# EAGLE design AccessControl (EAGLE 6.3)
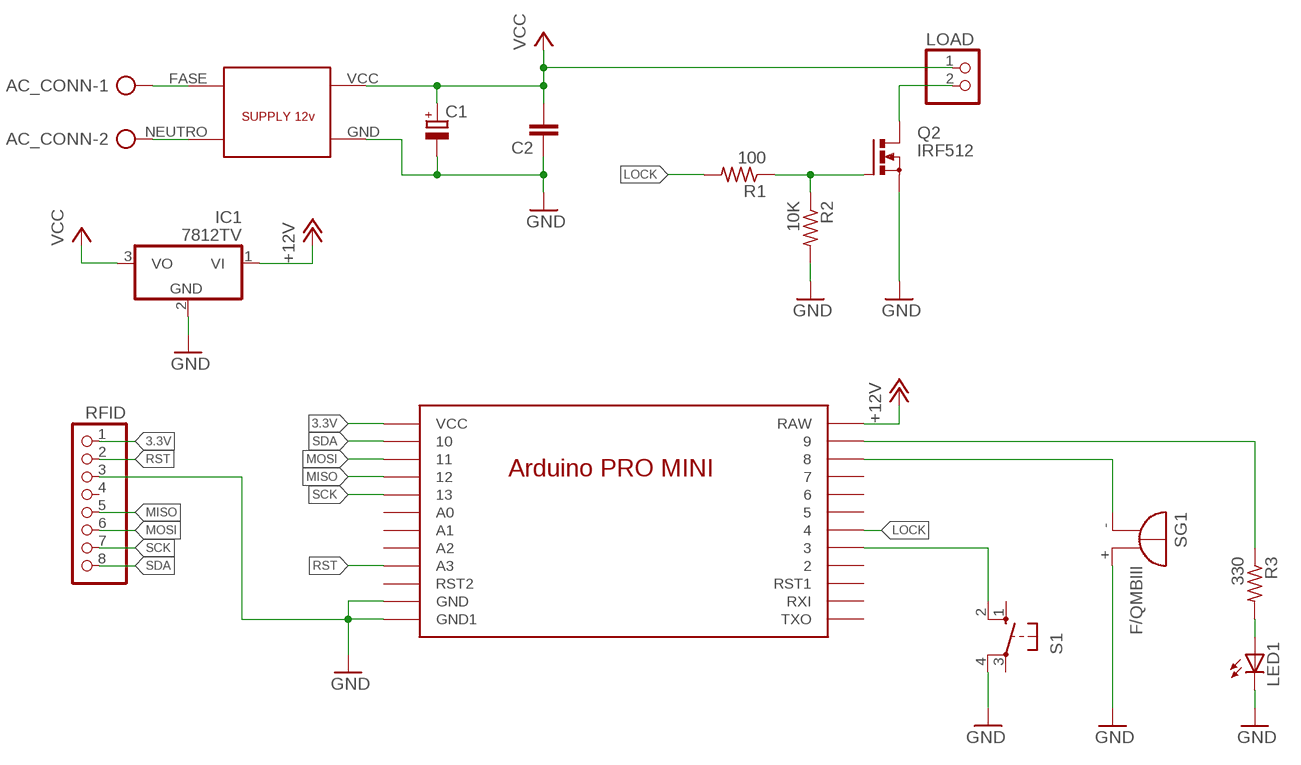
[diagram p0: schematic, sheet 1]

## Parts
AC_CONN  AK300/2  [AK300/2]
C1  CPOL-EUE2.5-6  [E2,5-6]
C2  C2.5/2  [C2.5-2]
IC1  7812TV  [TO220V]
LED1  LED3MM  [LED3MM]
LOAD  PINHD-1X2  [1X02]
Q2  IRF512  [TO220BV]
R1  100  R-US_0204/7  [0204/7]
R2  10K  R-US_0204/7  [0204/7]
R3  330  R-US_0204/7  [0204/7]
RFID  PINHD-1X8  [1X08]
S1  10-XX  [B3F-10XX]
SG1  F/QMBIII  [F/QMBIII]
U$1  NANO  [NANO]
U$2  SUPPLY12V  [SUPPLY12V]

## Nets
3.3V: RFID.1 U$1.VCC
+12V: IC1.1(VI) U$1.RAW
GND: C1.- C2.1 IC1.2(GND) LED1.K(C) Q2.S R2.2 RFID.3 S1.4(P1) SG1.+(-) U$1.GND1(GND) U$1.GND2(GND1) U$2.GND
LOCK: R1.2 U$1.4
MISO: RFID.5 U$1.12
MOSI: RFID.6 U$1.11
N$1: Q2.G R1.1 R2.1
N$2: AC_CONN.2 U$2.NEUTRO
N$3: LOAD.2 Q2.D
N$4: LED1.A R3.2
N$5: AC_CONN.1 U$2.FASE
N$6: SG1.-(+) U$1.8
N$7: S1.2(S1) U$1.3
N$8: R3.1 U$1.9
RST: RFID.2 U$1.A3
SCK: RFID.7 U$1.13
SDA: RFID.8 U$1.10
VCC: C1.+ C2.2 IC1.3(VO) LOAD.1 U$2.VCC
Unconnected: RFID.4 S1.1(S) S1.3(P) U$1.2 U$1.5 U$1.6 U$1.7 U$1.A0 U$1.A1 U$1.A2 U$1.RST1 U$1.RST2 U$1.RXI U$1.TXO

## Library data of the parts
AC_CONN = con-ptr500:AK300/2: CONNECTOR; OC_FARNELL: unknown; OC_NEWARK: unknown
C1 = resistor:CPOL-EU: POLARIZED CAPACITOR, European symbol
C2 = capacitor-wima:C: CAPACITOR naming: grid - package width
IC1 = linear:78*: Positive VOLTAGE REGULATOR Source: http://cache.national.com/ds/LM/LM78L05.pdf http://www.fairchildsemi.com/ds/LM/LM7805.pdf
LED1 = led:LED: LED OSRAM: - CHIPLED LG R971, LG N971, LY N971, LG Q971, LY Q971, LO R971, LY R971 LH N974, LH R974 LS Q976, LO Q976, LY Q976 LO Q996 - Hyper CHIPLED LW Q18S LB Q993, LB Q99A, LB R99A - SideLED LS A670, LO A670, LY A670, LG A670, LP A670 LB A673, LV A673, LT A673, LW A673 LH A674 LY A675 LS A676, LA A676, LO A676, LY A676, LW A676 LS A679, LY A679, LG A679 - Hyper Micro SIDELED® LS Y876, LA Y876, LO Y876, LY Y876 LT Y87S - SmartLED LW L88C, LW L88S LB L89C, LB L89S, LG L890 LS L89K, LO L89K, LY L89K LS L896, LA L896, LO L896, LY L896 - TOPLED LS T670, LO T670, LY T670, LG T670, LP T670 LSG T670, LSP T670, LSY T670, LOP T670, LYG T670 LG T671, LOG T671, LSG T671 LB T673, LV T673, LT T673, LW T673 LH T674 LS T676, LA T676, LO T676, LY T676, LB T676, LH T676, LSB T676, LW T676 LB T67C, LV T67C, LT T67C, LS T67K, LO T67K, LY T67K, LW E67C LS E67B, LA E67B, LO E67B, LY E67B, LB E67C, LV E67C, LT E67C LW T67C LS T679, LY T679, LG T679 LS T770, LO T770, LY T770, LG T770, LP T770 LB T773, LV T773, LT T773, LW T773 LH T774 LS E675, LA E675, LY E675, LS T675 LS T776, LA T776, LO T776, LY T776, LB T776 LHGB T686 LT T68C, LB T68C - Hyper Mini TOPLED® LB M676 - Mini TOPLED Santana® LG M470 LS M47K, LO M47K, LY M47K Source: http://www.osram.convergy.de LUXEON: - LUMILED® LXK2-PW12-R00, LXK2-PW12-S00, LXK2-PW14-U00, LXK2-PW14-V00 LXK2-PM12-R00, LXK2-PM12-S00, LXK2-PM14-U00 LXK2-PE12-Q00, LXK2-PE12-R00, LXK2-PE12-S00, LXK2-PE14-T00, LXK2-PE14-U00 LXK2-PB12-K00, LXK2-PB12-L00, LXK2-PB12-M00, LXK2-PB14-N00, LXK2-PB14-P00, LXK2-PB14-Q00 LXK2-PR12-L00, LXK2-PR12-M00, LXK2-PR14-Q00, LXK2-PR14-R00 LXK2-PD12-Q00, LXK2-PD12-R00, LXK2-PD12-S00 LXK2-PH12-R00, LXK2-PH12-S00 LXK2-PL12-P00, LXK2-PL12-Q00, LXK2-PL12-R00 Source: www.luxeon.com KINGBRIGHT: KA-3528ASYC Source: www.kingbright.com
LOAD = pinhead:PINHD-1X2: PIN HEADER
Q2 = transistor-power:IRF512: N-CHANNEL MOS FET
R1-R3 = resistor:R-US_: RESISTOR, American symbol
RFID = pinhead:PINHD-1X8: PIN HEADER
S1 = switch-omron:10-XX: OMRON SWITCH; MPN: B3F-1000; OC_FARNELL: 176432; OC_NEWARK: 36M3542
SG1 = buzzer:F/QMBIII: BUZZER Source: Buerklin; OC_FARNELL: unknown; OC_NEWARK: unknown
U$1 = E-Lab:NANO
U$2 = E-Lab:SUPPLY12V

## Board
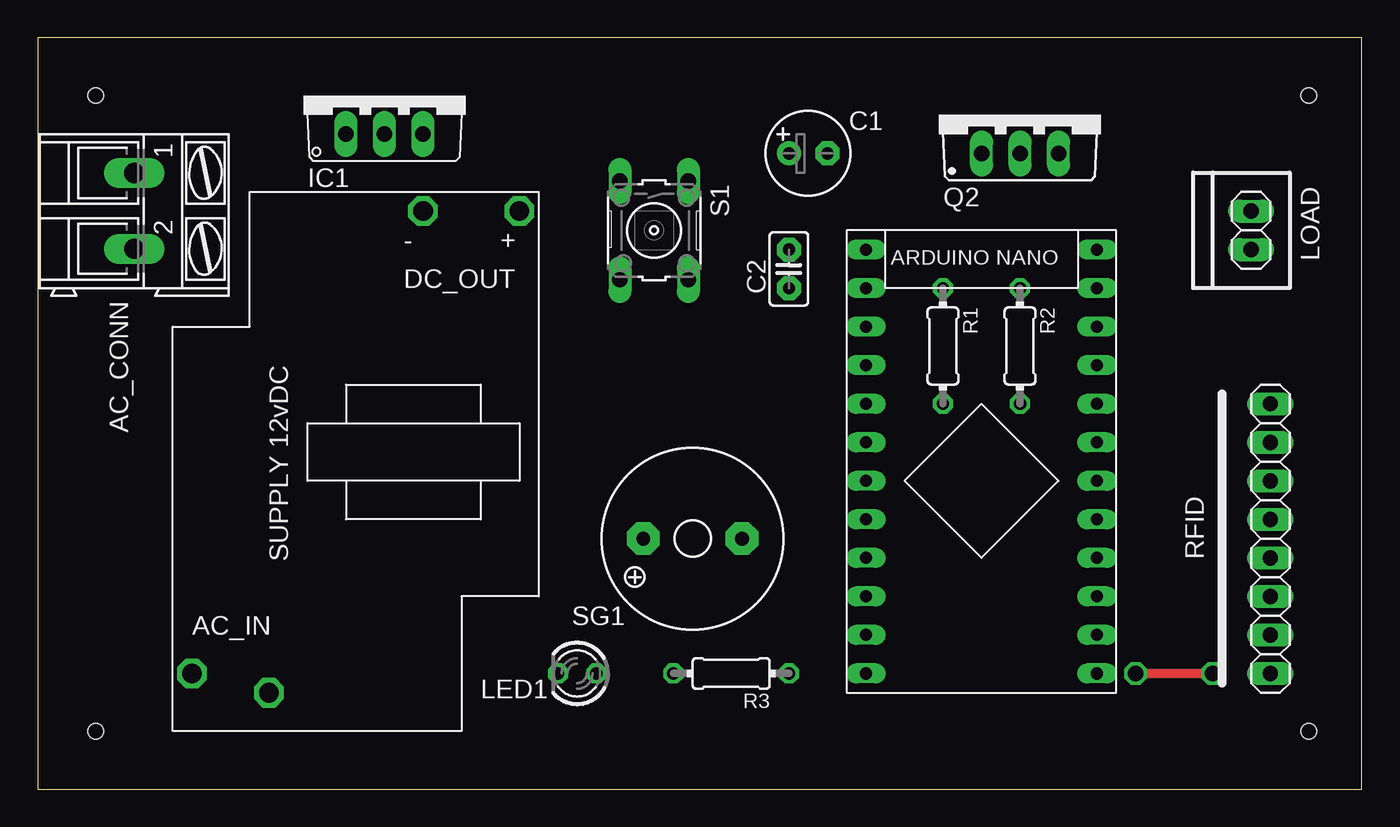
[diagram p1: board, top side]
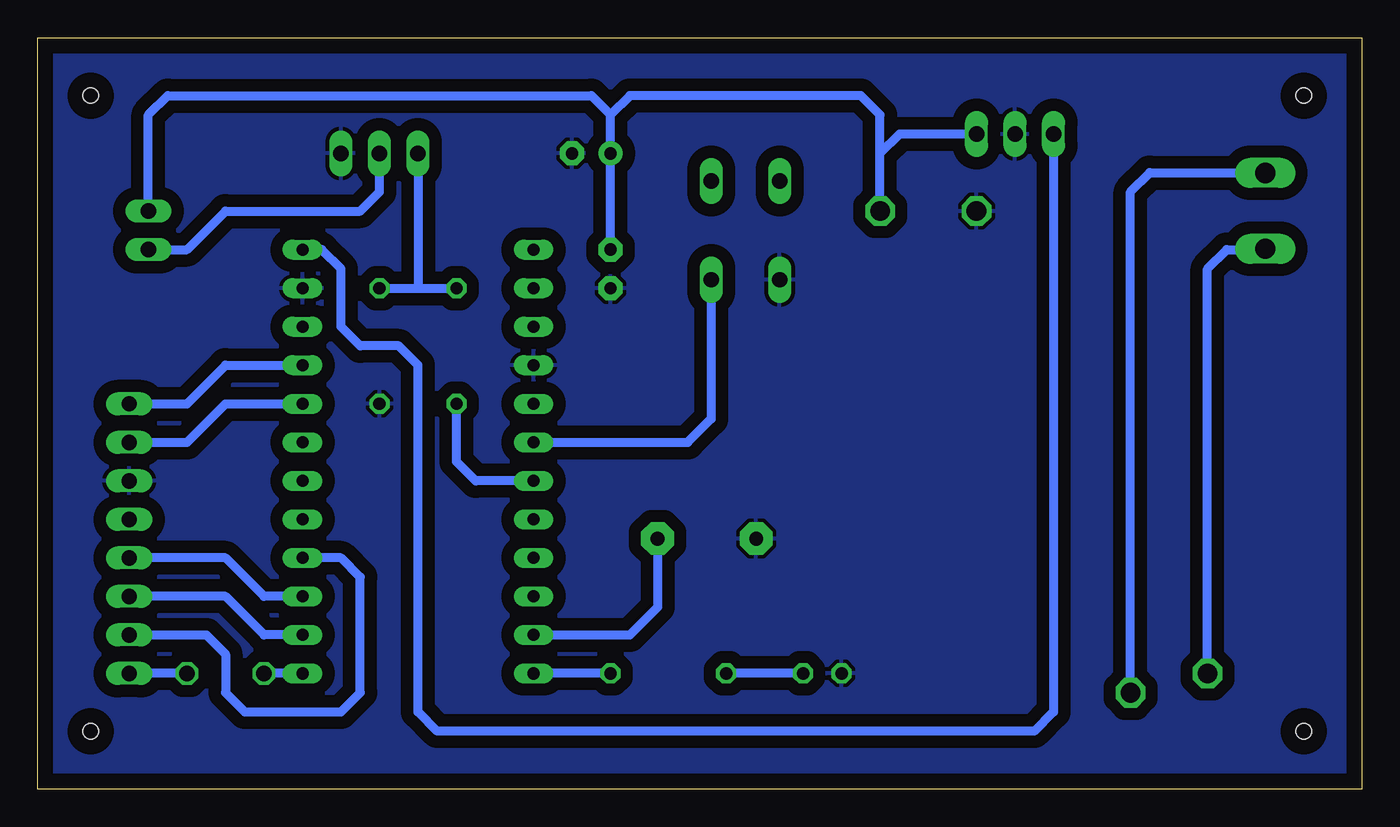
[diagram p2: board, bottom side, seen from below]

Size 87.3 x 49.52 mm. Coordinates in mm from the lower left corner, seen from the top.
Outline: 0,0 87.3,0 87.3,49.52 0,49.52 0,0
Copper layers (1*16): Top 0.035mm / dielectric 1.5mm / Bottom 0.035mm
Design rules "default": minimum track width 10mil, minimum drill 24mil, track to track 8mil, track to pad 8mil, pad to pad 8mil, via to via 8mil, smd to smd 8mil, copper to edge 40mil, drill to drill 8mil, minimum pad ring 10mil, minimum via ring 8mil, stop-mask expansion 4mil, vias tented up to drill 0mil, thermal gap 10mil
Holes 1 mm at 3.81,3.81 3.81,45.72 83.82,45.72 83.82,3.81

### Footprints (pad centres in the part's own frame; a part is rotated, then mirrored left to right if it is on the bottom)
AK300/2 = drill 1.321 long: 1 -2.515,0; 2 2.489,0
E2,5-6 = drill 0.813 pad 1.6: + -1.27,0 | drill 0.813 pad 1.6 octagon: - 1.27,0
C2.5-2 = drill 0.813 pad 1.6 octagon: 1 -1.27,0; 2 1.27,0
TO220V = drill 1.016 long: 1 -2.54,-2.54; 2 0,-2.54; 3 2.54,-2.54
LED3MM = drill 0.813 octagon: A -1.27,0; K 1.27,0
1X02 = drill 1.016 long: 1 -1.27,0; 2 1.27,0
TO220BV = drill 1.016 long: D 0,-2.54; G -2.54,-2.54; S 2.54,-2.54
0204/7 = drill 0.813 octagon: 1 -3.81,0; 2 3.81,0
1X08 = drill 1.016 long: 1 -8.89,0; 2 -6.35,0; 3 -3.81,0; 4 -1.27,0; 5 1.27,0; 6 3.81,0; 7 6.35,0; 8 8.89,0
B3F-10XX = drill 1.016 long: 1 -3.251,2.261; 2 3.251,2.261; 3 -3.251,-2.261; 4 3.251,-2.261
F/QMBIII = drill 0.914 pad 2.159 octagon: + 3.251,0; - -3.251,0
NANO = drill 0.8 long: 2 7.62,-5.08; 3 7.62,-2.54; 4 7.62,0; 5 7.62,2.54; 6 7.62,5.08; 7 7.62,7.62; 8 7.62,10.16; 9 7.62,12.7; 10 -7.62,12.7; 11 -7.62,10.16; 12 -7.62,7.62; 13 -7.62,5.08; A0 -7.62,2.54; A1 -7.62,0; A2 -7.62,-2.54; A3 -7.62,-5.08; GND1 -7.62,-12.7; GND2 7.62,-7.62; RAW -7.62,-15.24; RST1 -7.62,-10.16; RST2 7.62,-10.16; RXI 7.62,-12.7; TXO 7.62,-15.24; VCC -7.62,-7.62
SUPPLY12V = drill 1.3 octagon: FASE 15.24,-5.08; GND -16.51,5.08; NEUTRO 13.97,-10.16; VCC -16.51,11.43

### Placement (x,y rotation side)
AC_CONN  6.35,38.1 270 top
C1  50.8,41.91 0 top
C2  49.53,34.29 90 top
IC1  22.86,45.72 0 top
LED1  35.56,7.62 180 top
LOAD  80.01,36.83 270 top
Q2  64.77,44.45 0 top
R1  59.69,29.21 270 top
R2  64.77,29.21 270 top
R3  45.72,7.62 180 top
RFID  81.28,16.51 270 top
S1  40.64,36.83 270 top
SG1  43.18,16.51 180 top
U$1  62.23,20.32 180 top
U$2  20.32,21.59 270 top

### Tracks (layer width: path | path; a pad name or v marks a point on that pad's centre or on a via)
3.3V
  Bottom 0.61: RFID.1 77.47,25.4 74.93,27.94 U$1.VCC
+12V
  Bottom 0.61: IC1.1 20.32,5.08 21.59,3.81 60.96,3.81 62.23,5.08 62.23,27.94 63.5,29.21 66.04,29.21 67.31,30.48 67.31,34.29 68.58,35.56 U$1.RAW
GND
  pour Bottom (isolate 0.813): 0,0 0,49.53 87.63,49.53 87.63,0
LOCK
  Bottom 0.61: U$1.4 58.42,20.32 59.69,21.59 R1.2
MISO
  Bottom 0.61: U$1.12 72.39,12.7 74.93,15.24 RFID.5
MOSI
  Bottom 0.61: U$1.11 72.39,10.16 74.93,12.7 RFID.6
N$1
  Bottom 0.61: R2.1 62.23,33.02 | 62.23,33.02 R1.1 | Q2.G 62.23,33.02
N$2
  Bottom 0.61: U$2.NEUTRO 10.16,34.29 8.89,35.56 6.4,35.56 AC_CONN.2
N$3
  Bottom 0.61: Q2.D 64.77,39.37 66.04,38.1 74.93,38.1 77.47,35.56 LOAD.2
N$4
  Bottom 0.61: LED1.A R3.2
N$5
  Bottom 0.61: U$2.FASE 15.24,39.37 13.97,40.64 6.38,40.64 AC_CONN.1
N$6
  Bottom 0.61: U$1.8 48.26,10.16 46.43,11.99 SG1.-
N$7
  Bottom 0.61: U$1.3 44.45,22.86 42.9,24.41 S1.2
N$8
  Bottom 0.61: R3.1 U$1.9
RST
  Bottom 0.61: RFID.2 77.47,22.86 74.93,25.4 U$1.A3
SCK
  Bottom 0.61: RFID.7 76.2,10.16 74.93,8.89 74.93,6.35 73.66,5.08 67.31,5.08 66.04,6.35 66.04,13.97 67.31,15.24 U$1.13
SDA  (via drill 1)
  Top 0.61: v72.39,7.62 v77.47,7.62
  Bottom 0.61: U$1.10 v72.39,7.62 | v77.47,7.62 RFID.8
VCC
  Bottom 0.61: C2.2 C1.+ 49.53,44.45 | U$2.VCC 31.75,41.91 | 31.75,41.91 31.75,44.45 33.02,45.72 48.26,45.72 49.53,44.45 | 49.53,44.45 50.8,45.72 78.74,45.72 80.01,44.45 LOAD.1 | IC1.3 30.48,43.18 31.75,41.91